# EasyEDA Pro project Schematics with ESP32.eprj

# Schematic Parallel
Board Name: Board1; Create Date: 2026-05-12; Page Name: P1; Project Name: Schematics with ESP32; Schematic Name: Parallel; Update Date: 2026-05-12; Company: EasyEDA.com; Page Size: A4; Version: V1.0
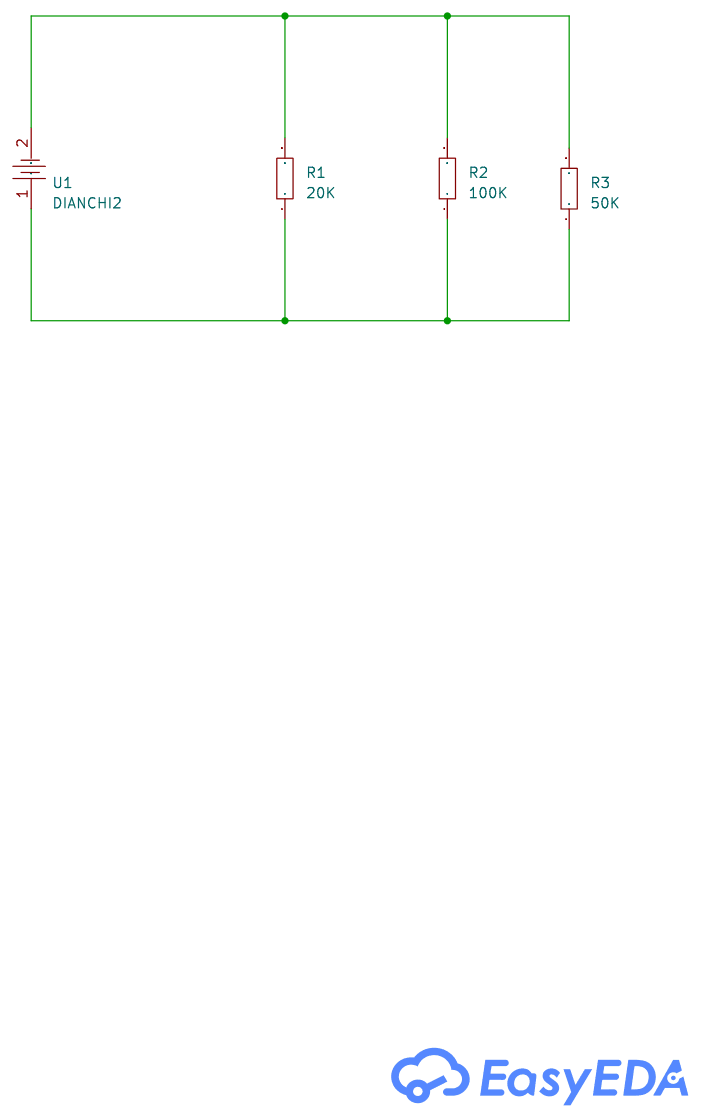
[diagram p0: schematic sheet]

## Parts
R1  20K  [R0603]
R2  100K  [R0603]
R3  50K  [R0603]
U1  DIANCHI2  [BAT-SMD_DIANCHI2]

## Library data of the parts
R1-R3 = Res_0603: Supplier Footprint: 0603
U1 = DIANCHI2: Supplier Part: C9900013521; Supplier Footprint: Battery-125V; JLCPCB Part Class: Extended Part; Supplier: LCSC

## Nets
Net-(R1-1): R1.1 R2.1 R3.1 U1.1
Net-(R1-2): R1.2 R2.2 R3.2 U1.2

# Schematic Series
Create Date: 2026-05-12; Page Name: P1; Project Name: Schematics with ESP32; Schematic Name: Series; Update Date: 2026-05-12; Company: EasyEDA.com; Page Size: A4; Version: V1.0
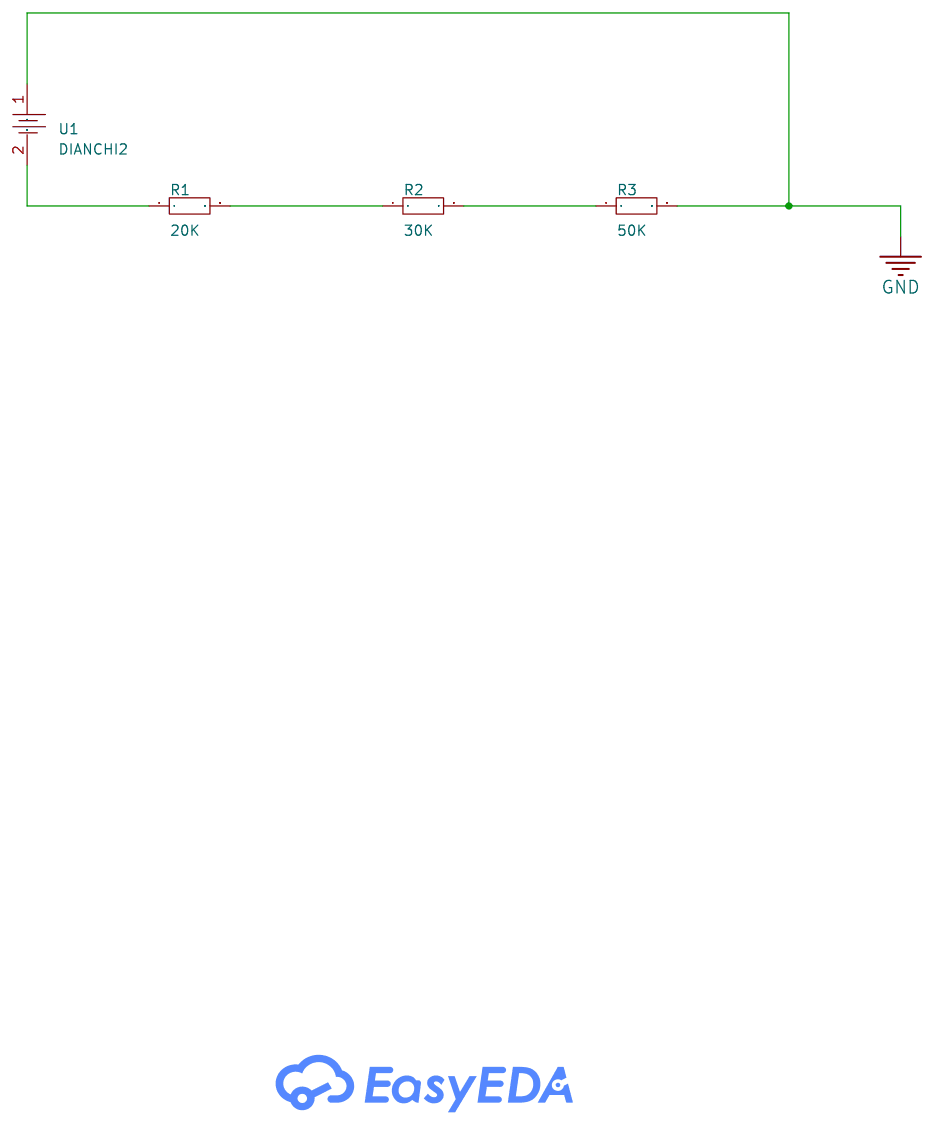
[diagram p1: schematic sheet]

## Parts
R1  20K  [R0603]
R2  30K  [R0603]
R3  50K  [R0603]
U1  DIANCHI2  [BAT-SMD_DIANCHI2]

## Library data of the parts
R1-R3 = Res_0603: Supplier Footprint: 0603
U1 = DIANCHI2: Supplier Part: C9900013521; Supplier Footprint: Battery-125V; JLCPCB Part Class: Extended Part; Supplier: LCSC

## Nets
GND: R3.2 U1.1
Net-(R1-1): R1.1 U1.2
Net-(R1-2): R1.2 R2.1
Net-(R2-2): R2.2 R3.1

# Schematic ESP32 connected to DHT22
Create Date: 2026-05-12; Page Name: P1; Project Name: Schematics with ESP32; Schematic Name: ESP32 connected to DHT22; Update Date: 2026-05-12; Company: EasyEDA.com; Page Size: A4; Version: V1.0
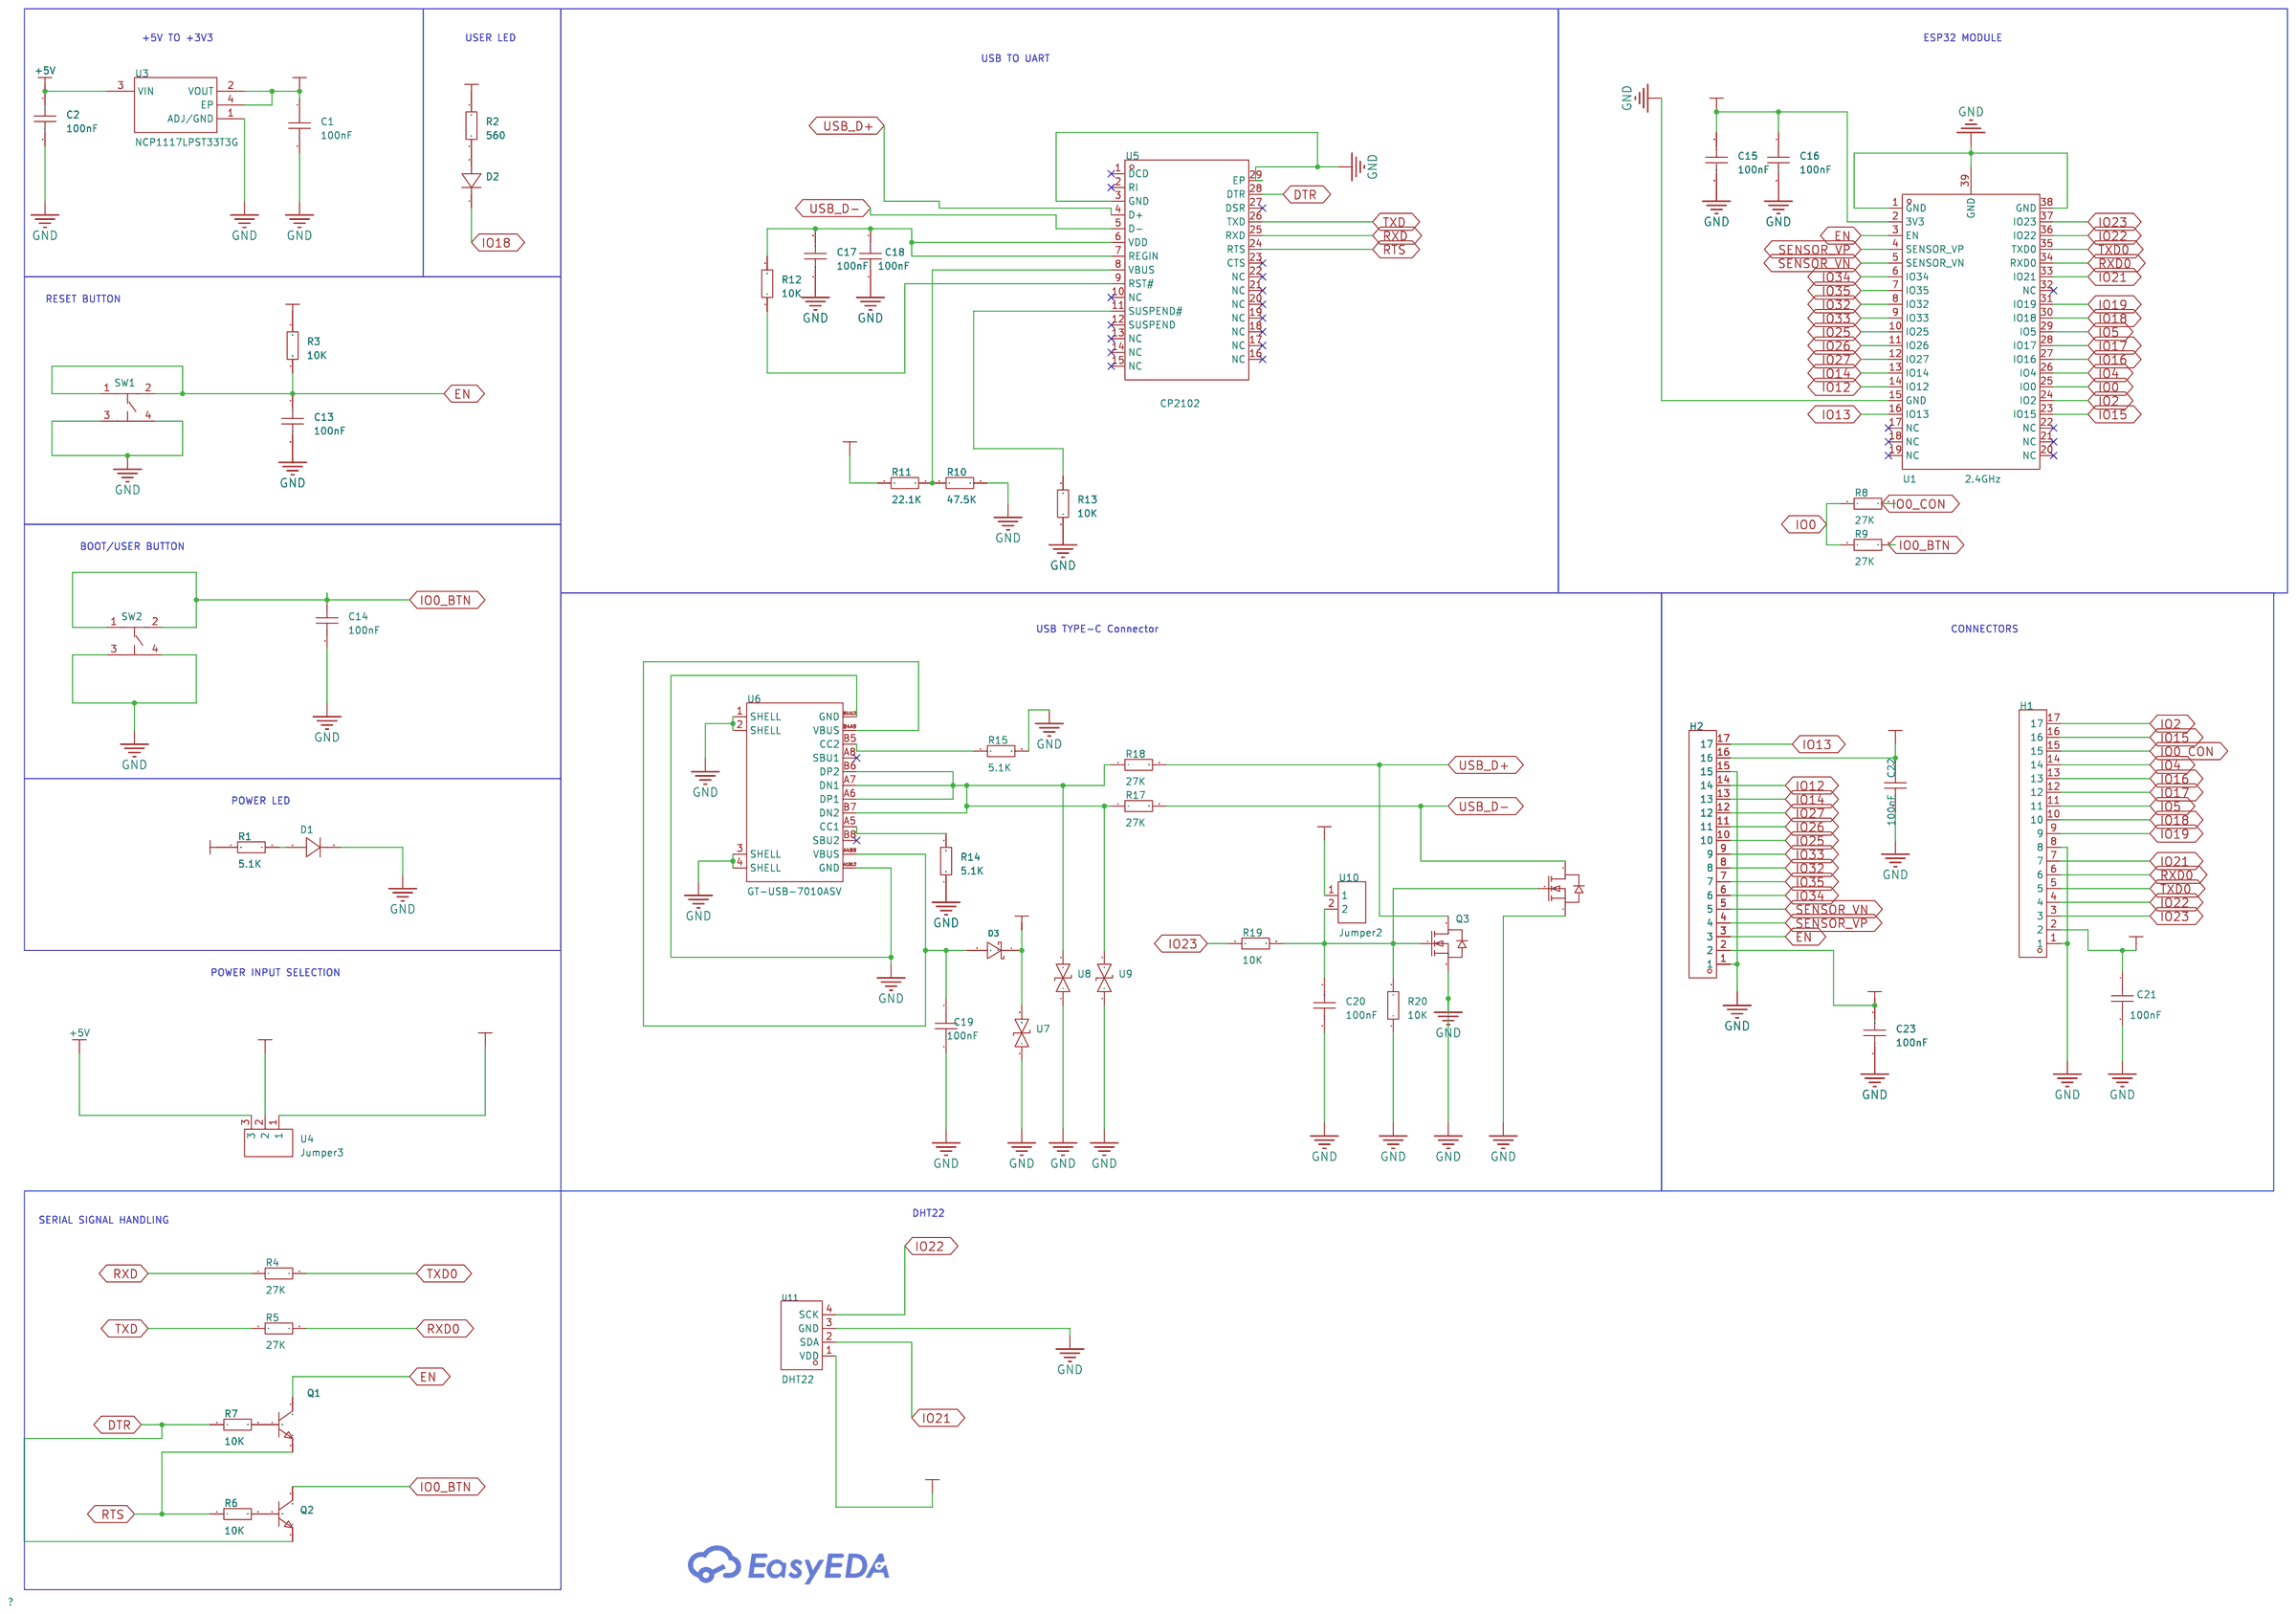
[diagram p2: schematic sheet]

## Parts
C1  100nF  [C0603]
C2  100nF  [C0603]
C13  100nF  [C0603]
C14  100nF  [C0603]
C15  100nF  [C0603]
C16  100nF  [C0603]
C17  100nF  [C0603]
C18  100nF  [C0603]
C19  100nF  [C0603]
C20  100nF  [C0603]
C21  100nF  [C0603]
C22  100nF  [C0603]
C23  100nF  [C0603]
D1  -  [SMA_L4.4-W2.8-LS5.4-RD]
D2  -  [SMA_L4.4-W2.8-LS5.4-RD]
D3  B5819W-TP  [SOD-123_L2.8-W1.8-LS3.7-RD]
H1  X6511WV-17H-C60D30  [HDR-TH_17P-P2.54-V-M]
H2  X6511WV-17H-C60D30  [HDR-TH_17P-P2.54-V-M]
Q1  PBSS4240  [SOT-23-3_L2.9-W1.3-P1.90-LS2.4-BR]
Q2  PBSS4240  [SOT-23-3_L2.9-W1.3-P1.90-LS2.4-BR]
Q3  LM-2N7002LT1G  [SOT-23-3_L2.9-W1.3-P1.90-LS2.4-BR]
Q4  LM-2N7002LT1G  [SOT-23-3_L2.9-W1.3-P1.90-LS2.4-BR]
R1  5.1K  [R0603]
R2  560  [R0603]
R3  10K  [R0603]
R4  27K  [R0603]
R5  27K  [R0603]
R6  10K  [R0603]
R7  10K  [R0603]
R8  27K  [R0603]
R9  27K  [R0603]
R10  47.5K  [R0603]
R11  22.1K  [R0603]
R12  10K  [R0603]
R13  10K  [R0603]
R14  5.1K  [R0603]
R15  5.1K  [R0603]
R17  27K  [R0603]
R18  27K  [R0603]
R19  10K  [R0603]
R20  10K  [R0603]
SW1  HX 5.2x5.2x1.5H SWITCH TACTILE  [SW-SMD_4P-L5.2-W5.2-P3.7-LS6.4-1]
SW2  HX 5.2x5.2x1.5H SWITCH TACTILE  [SW-SMD_4P-L5.2-W5.2-P3.7-LS6.4-1]
U1  2.4GHz  [WIFI-SMD_ESP32-WROOM-32E]
U3  NCP1117LPST33T3G  [SOT-223_L6.5-W3.5-P2.30-LS7.0-BR]
U4  Jumper3  [HDR-TH_3P-P2.54-V-M-A]
U5  CP2102  [QFN-28_L5.0-W5.0-P0.50-TL-EP3.2]
U6  GT-USB-7010ASV  [USB-C-SMD_G-SWITCH_GT-USB-7010ASV]
U7  LESD5D5.0CT1G-ES  [SOD-523_L1.2-W0.8-LS1.6-BI]
U8  LESD5D5.0CT1G-ES  [SOD-523_L1.2-W0.8-LS1.6-BI]
U9  LESD5D5.0CT1G-ES  [SOD-523_L1.2-W0.8-LS1.6-BI]
U10  Jumper2  [HDR-TH_2P-P2.54-V-M-1]
U11  DHT22  [SENSOR-TH_HAIGU_DHT22]

## Library data of the parts
C1 C2 C13-C23 = CAP_0603: Supplier Footprint: 0603
D1 D2 = 1N4007: Supplier Footprint: SMA(DO-214AC); Supplier Part: C727081
D3 = B5819W-TP: LCSC Part Name: 电压:40V 电流:1A; Supplier Part: C84354; Manufacturer: MCC(美微科); Supplier Footprint: SOD-123; JLCPCB Part Class: Extended Part; Datasheet: https://item.szlcsc.com/datasheet/B5819W-TP/85524.html; Supplier: LCSC; Voltage - Forward(Vf@If): 600mV@1A; Voltage - DC Reverse(Vr): 40V; Current - Rectified: 1A; Reverse Leakage Current (Ir): 1mA@40V; Operating Junction Temperature Range: -65℃~+125℃; Non-Repetitive Peak Forward Surge Current: 10A
H1 H2 = X6511WV-17H-C60D30: LCSC Part Name: 1x17P 间距:2.54mm 方针; Supplier Part: C725949; Manufacturer: XKB Connection(中国星坤); Supplier Footprint: 插件,P=2.54mm; JLCPCB Part Class: Extended Part; Datasheet: https://item.szlcsc.com/datasheet/X6511WV-17H-C60D30/772398.html; Supplier: LCSC; Pin Structure: 1x17P; Pitch: 2.54mm; Row Spacing: 2.54mm; Circluar Pins/Square Pins: Pin Header; Number of Rows: 1; Number of Pins: 17P; Current Rating: 3A; Voltage Rating (Max): 250V; Insulation Height: 2.5mm; Contact Material: Brass; Contact Plating: Gold; Operating Temperature: -40℃~+105℃; Color: Black
Q1 Q2 = PBSS4240: LCSC Part Name: 耐压:40V 电流:2A NPN; Supplier Part: C50176435; Manufacturer: GOODWORK(固得沃克); Supplier Footprint: SOT-23; JLCPCB Part Class: Extended Part; Datasheet: https://item.szlcsc.com/datasheet/PBSS4240/52750470.html; Supplier: LCSC; type: NPN; Current - Collector(Ic): 2A; Collector - Emitter Voltage VCEO: 40V; Pd - Power Dissipation: 300mW; DC Current Gain: 470; Transition frequency(fT): 230MHz; Current - Collector Cutoff: 100nA; Vce Saturation(VCE(sat)): 45mV; Operating Temperature: -65℃~+150℃; Emitter-Base Voltage(Vebo): 5V; Number: 1 NPN; Configuration: Independent
Q3 Q4 = LM-2N7002LT1G: LCSC Part Name: N沟道增强型场效应晶体管; Supplier Part: C5353602; Manufacturer: Leiditech(雷卯电子); Supplier Footprint: SOT-23; JLCPCB Part Class: Extended Part; Datasheet: https://item.szlcsc.com/datasheet/LM-2N7002LT1G/6144172.html; Supplier: LCSC; Number: One N-channel; Drain to Source Voltage: 60V; Current - Continuous Drain(Id): 340mA; RDS(on): 3Ω@4.5V; Pd - Power Dissipation: 350mW; Gate Threshold Voltage (Vgs(th)): 1.5V; Gate Charge(Qg): 2.4nC@10V; Input Capacitance(Ciss): 16pF@30V; Reverse Transfer Capacitance (Crss@Vds): 5.5pF@30V; Operating Temperature: -55℃~+150℃
R1-R15 R17-R20 = Res_0603: Supplier Footprint: 0603
SW1 SW2 = HX 5.2x5.2x1.5H SWITCH TACTILE: LCSC Part Name: 5.2*5.2*1.5mm 立贴 轻触开关; Supplier Part: C49234130; Manufacturer: hanxia(韩下); Supplier Footprint: SMD; JLCPCB Part Class: Extended Part; Datasheet: https://item.szlcsc.com/datasheet/HX%25205.2x5.2x1.5H%2520SWITCH%2520TACTILE/51650191.html; Supplier: LCSC; Circuit: SPST; Actuator Style: Round Button; Operating Force: 2.5N; Mounting Type: Surface Mount,Vertical; Length: 5.2mm; Width: 5.2mm; Switch Height: 1.5mm; with Bracket: Without Bracket; Contact Current: 50mA; Voltage Rating: 12V; Actuator/Cap Color: Yellow; With Lamp: No; Termination Style: SMD(SMT) Tab; Life: 100,000 Cycles
U1 = ESP32-WROOM-32E-N8: LCSC Part Name: 不带固件 通用型Wi-Fi+BT+BLE MCU模组; Supplier Part: C701342; Manufacturer: ESPRESSIF(乐鑫); Supplier Footprint: SMD,25.5x18mm; JLCPCB Part Class: Extended Part; Datasheet: https://item.szlcsc.com/datasheet/ESP32-WROOM-32E-N8/736350.html; Supplier: LCSC; Utilized IC / Part: ESP32-DOWD-V3; Wireless Standard: Bluetooth4.2; Interface Type: I2C；GPIO；UART；SPI；PWM；SDIO；I2S; Antenna Type: On-board PCB Antenna; Output Power: 20dBm; Voltage - Supply: 3V~3.6V; Receive  Current: 112mA; Send  Current: 239mA; Sensitivity: -98dBm; Operating Temperature: -40℃~+85℃
U3 = NCP1117LPST33T3G: LCSC Part Name: 输入18V 输出3.3V 1A; Supplier Part: C146799; Manufacturer: onsemi(安森美); Supplier Footprint: SOT-223; JLCPCB Part Class: Extended Part; Datasheet: https://item.szlcsc.com/datasheet/NCP1117LPST33T3G/158131.html; Supplier: LCSC; Output Type: Fixed; Voltage - Supply: 18V; Output Voltage: 3.3V; Output Current: 1A; Power Supply Rejection Ratio (PSRR): 60dB@(120Hz); Voltage Dropout: 1.3V@(1A); standby current: 550uA; Features: Over Temperature Protection；Over Current Protection; Operating Temperature: 0℃~+125℃; Output Configuration: Positive; Number of Outputs: 1
U4 = Jumper3: Supplier Part: C2940050; Supplier Footprint: HDR-TH-3P-2.54mm; JLCPCB Part Class: Extended Part; Supplier: LCSC
U5 = CP2102: Supplier Part: C9900004371; Supplier Footprint: QFN-28-EP(5x5); JLCPCB Part Class: Extended Part; Supplier: LCSC
U6 = GT-USB-7010ASV: LCSC Part Name: Type-C 母 卧贴; Supplier Part: C2988369; Manufacturer: G-Switch(品赞); Supplier Footprint: SMD; JLCPCB Part Class: Extended Part; Datasheet: https://item.szlcsc.com/datasheet/GT-USB-7010ASV/3445595.html; Supplier: LCSC; Connector Type: Type-C; Protocol Standard: USB 2.0; Gender: Female; Mounting Type: Surface Mount, Right Angle; Number of Contacts: 16P; Number of Ports: 1; Current Rating-Power: 3A; Voltage Rating: 24V; Connect-Disconnect Life: 10,000 cycles; Center Height: 1.68mm; Length: 7.35mm; Detection color: Black; Operating Temperature: -40℃~+85℃
U7-U9 = LESD5D5.0CT1G-ES: LCSC Part Name: 普容5.0V，单路双向ESD静电防护器件，30kV，CJ：12pF；音频/视频/通讯防护; Supplier Part: C5199159; Manufacturer: ElecSuper(静芯微); Supplier Footprint: SOD523; JLCPCB Part Class: Extended Part; Datasheet: https://atta.szlcsc.com/upload/public/pdf/source/20240905/10776531C4DE5F6ADA679023752259EC.pdf; Supplier: LCSC; polarity: Bidirectional; Reverse Stand-Off Voltage (Vrwm): 5V; Maximum Clamping Voltage: 10V; Peak Pulse Current (Ipp): 8A; Peak Pulse Power Dissipation (Ppp): 80W; Breakdown Voltage: 5.8V; Reverse Leakage Current (Ir): 1uA; Number of Lines: Single channel; Type: ESD
U10 = Jumper2: Supplier Part: C2940092; Supplier Footprint: HDR-TH-2P-2.54mm; JLCPCB Part Class: Extended Part; Supplier: LCSC
U11 = DHT22: LCSC Part Name: 数字温湿度模块12mm*15.5mm*5.9mm; Supplier Part: C2880291; Manufacturer: HAIGU(广州海谷); Supplier Footprint: 插件; JLCPCB Part Class: Extended Part; Datasheet: https://atta.szlcsc.com/upload/public/pdf/source/20230523/7507864DBB8AF99FF82B5DD1568971DB.pdf; Supplier: LCSC; Temperature: -40℃~+80℃; Humidity: 5%RH~99%RH; Supply Voltage: 3.3V; Supply Current: 500uA; Resolution: ±3%RH

## Nets
+3V3: C1.1 C15.1 C16.1 C21.1 C23.1 H1.2 H2.2 R1.2 R2.2 R3.2 U1.2(3V3) U3.2(VOUT) U3.4(EP) U10.1 U11.1(VDD)
+5V: C2.1 U3.3(VIN) U4.3
+5V_EXT: C22.1 H2.16 U4.2
+5V_VBUS: D3.1(C) R11.1 U4.1 U7.2
GND: C1.2 C2.2 C13.2 C14.2 C15.2 C16.2 C17.1 C18.2 C19.2 C20.2 C21.2 C22.2 C23.2 D1.1(K) H1.1 H1.8 H2.1 H2.15 Q3.2(S) Q4.2(S) R10.2 R13.1 R14.1 R15.2 R20.1 SW1.3 SW1.4 SW2.3 SW2.4 U1.1(GND) U1.15(GND) U1.38(GND) U1.39(GND) U3.1(ADJ/GND) U5.3(GND) U5.29(EP) U6.1(SHELL) U6.2(SHELL) U6.3(SHELL) U6.4(SHELL) U6.A1B12(GND) U6.B1A12(GND) U7.1 U8.1 U9.1 U11.3(GND)
DTR: Q2.2(E) R7.1 U5.28(DTR)
EN: C13.1 H2.3 Q1.3(C) R3.1 SW1.1 SW1.2 U1.3(EN)
IO0: R8.1 R9.1 U1.25(IO0)
IO0_BTN: C14.1 Q2.3(C) R9.2 SW2.1 SW2.2
IO0_CON: H1.15 R8.2
IO2: H1.17 U1.24(IO2)
IO4: H1.14 U1.26(IO4)
IO5: H1.11 U1.29(IO5)
IO12: H2.14 U1.14(IO12)
IO13: H2.17 U1.16(IO13)
IO14: H2.13 U1.13(IO14)
IO15: H1.16 U1.23(IO15)
IO16: H1.13 U1.27(IO16)
IO17: H1.12 U1.28(IO17)
IO18: D2.1(K) H1.10 U1.30(IO18)
IO19: H1.9 U1.31(IO19)
IO21: H1.7 U1.33(IO21) U11.2(SDA)
IO22: H1.4 U1.36(IO22) U11.4(SCK)
IO23: H1.3 R19.1 U1.37(IO23)
IO25: H2.10 U1.10(IO25)
IO26: H2.11 U1.11(IO26)
IO27: H2.12 U1.12(IO27)
IO32: H2.8 U1.8(IO32)
IO33: H2.9 U1.9(IO33)
IO34: H2.6 U1.6(IO34)
IO35: H2.7 U1.7(IO35)
RTS: Q1.2(E) R6.1 U5.24(RTS)
RXD: R4.1 U5.25(RXD)
RXD0: H1.6 R5.2 U1.34(RXD0)
SENSOR_VN: H2.5 U1.5(SENSOR_VN)
SENSOR_VP: H2.4 U1.4(SENSOR_VP)
TXD: R5.1 U5.26(TXD)
TXD0: H1.5 R4.2 U1.35(TXD0)
USB_D+: Q3.3(D) R18.2 U5.4(D+)
USB_D-: Q4.3(D) R17.2 U5.5(D-)
Net-(C17-2): C17.2 C18.1 R12.2 U5.6(VDD) U5.7(REGIN)
Net-(C19-1): C19.1 D3.2(A) U6.A4B9(VBUS) U6.B4A9(VBUS)
Net-(C20-1): C20.1 Q3.1(G) Q4.1(G) R19.2 R20.2 U10.2
Net-(D1-2): D1.2(A) R1.1
Net-(D2-2): D2.2(A) R2.1
Net-(Q1-1): Q1.1(B) R7.2
Net-(Q2-1): Q2.1(B) R6.2
Net-(R10-1): R10.1 R11.2 U5.8(VBUS)
Net-(R12-1): R12.1 U5.9(RST#)
Net-(R13-2): R13.2 U5.11(SUSPEND#)
Net-(R14-2): R14.2 U6.A5(CC1)
Net-(R15-1): R15.1 U6.B5(CC2)
Net-(R17-1): R17.1 R18.1 U6.A6(DP1) U6.A7(DN1) U6.B6(DP2) U6.B7(DN2) U8.2 U9.2

Not connected (* = marked no-connect by the designer): U1 17(NC)* 18(NC)* 19(NC)* 20(NC)* 21(NC)* 22(NC)* 32(NC)*; U5 1(DCD)* 2(RI)* 10(NC)* 12(SUSPEND)* 13(NC)* 14(NC)* 15(NC)* 16(NC)* 17(NC)* 18(NC)* 19(NC)* 20(NC)* 21(NC)* 22(NC)* 23(CTS)* 27(DSR)*; U6 A8(SBU1)* B8(SBU2)*

## Notes on the sheet
- +5V TO +3V3
- USER LED
- ESP32 MODULE
- USB TO UART
- RESET BUTTON
- BOOT/USER BUTTON
- USB TYPE-C Connector
- CONNECTORS
- POWER LED
- POWER INPUT SELECTION
- SERIAL SIGNAL HANDLING
- DHT22
